# EAGLE design controller (EAGLE 6.3)
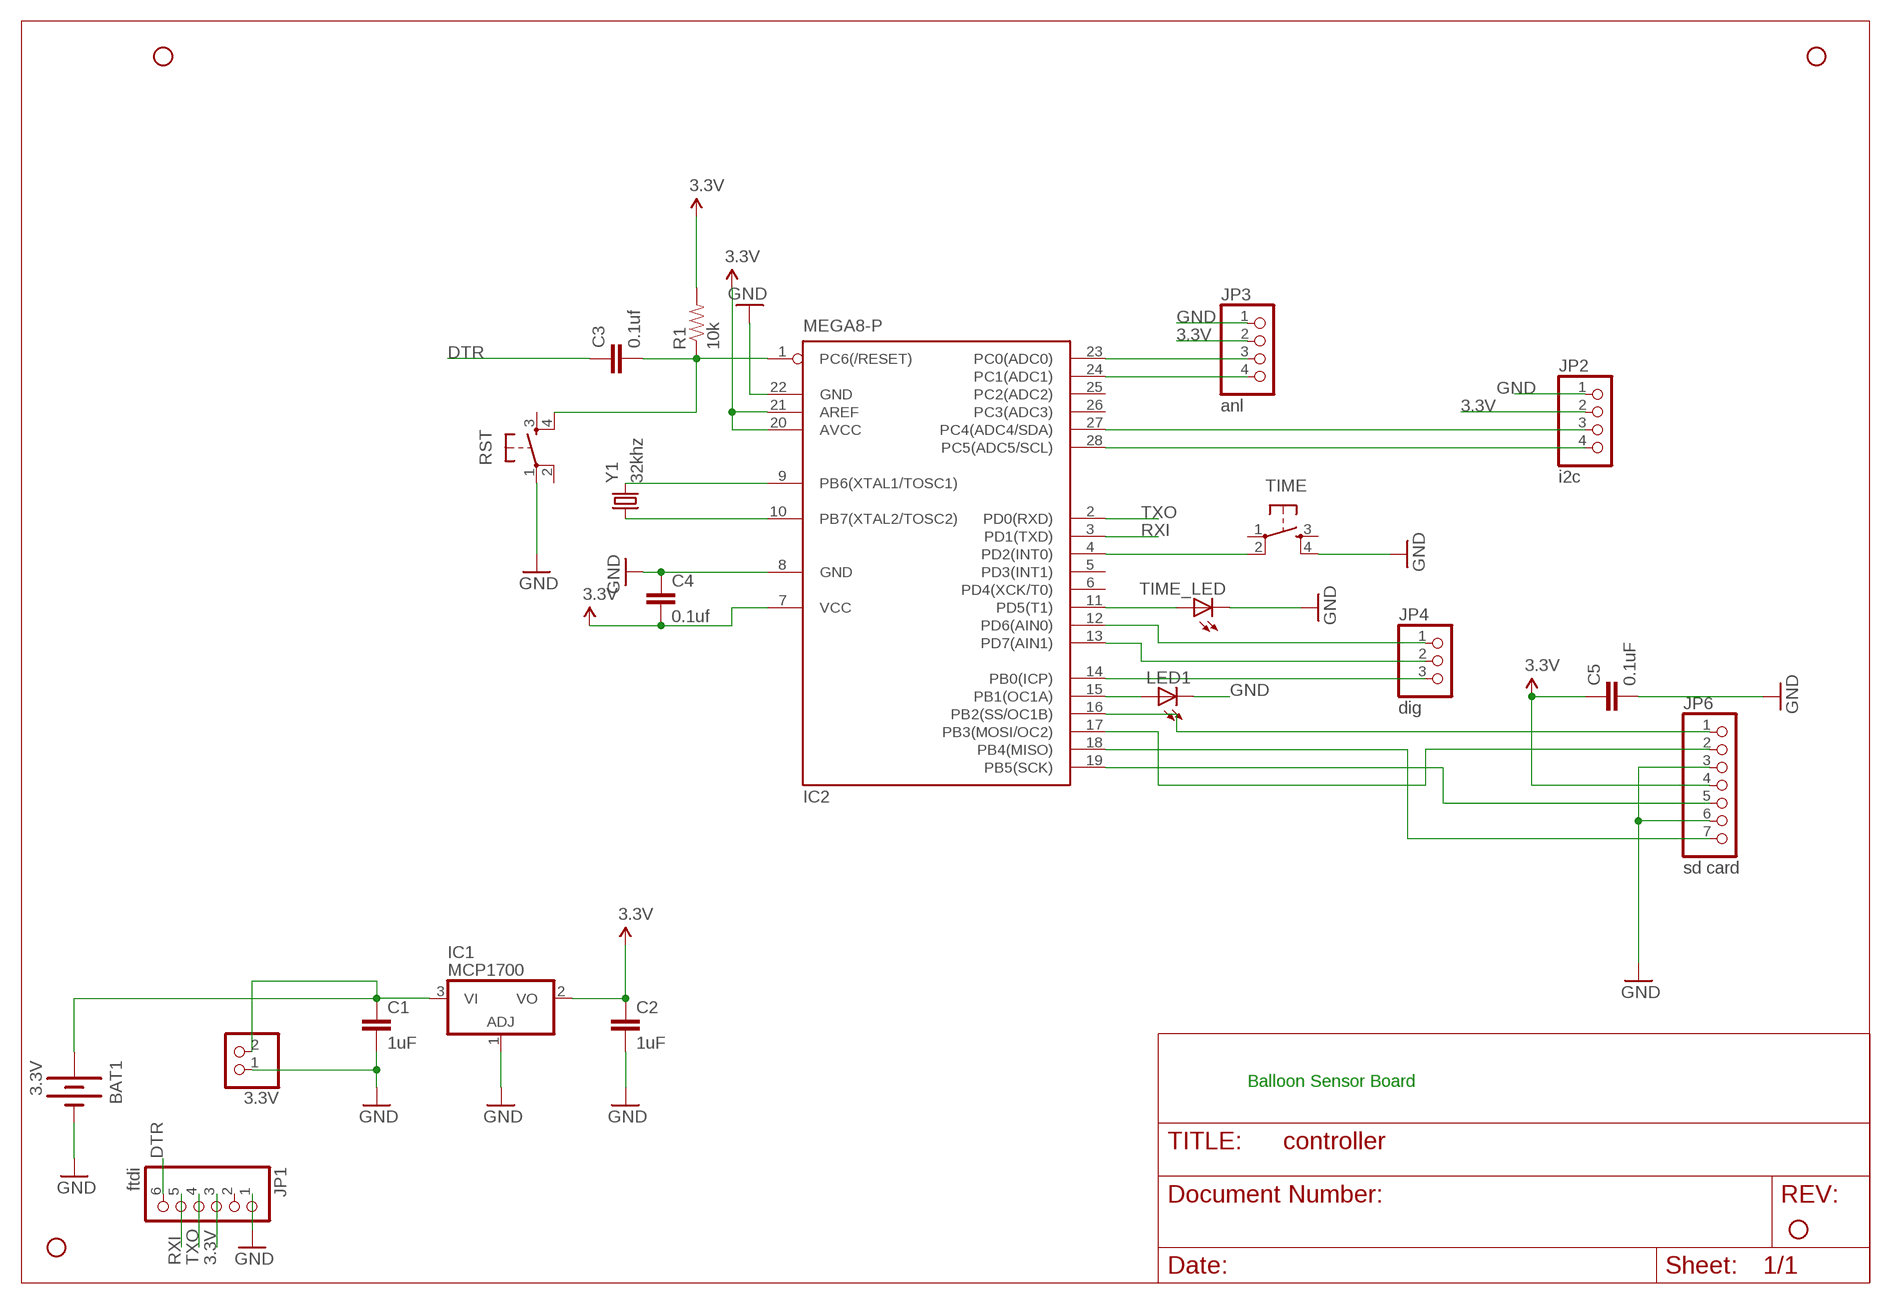
[diagram p0: schematic, sheet 1]

## Parts
3.3V  PINHD-1X2  [1X02]
BAT1  3.3V  BATTERY245MM  [BATTCON_245MM]
C1  1uF  CAPPTH1  [CAP-PTH-5MM]
C2  1uF  CAPPTH1  [CAP-PTH-5MM]
C3  0.1uf  CAPPTH1  [CAP-PTH-5MM]
C4  0.1uf  CAPPTH1  [CAP-PTH-5MM]
C5  0.1uF  CAPPTH1  [CAP-PTH-5MM]
IC1  MCP1700  LM317LZ  [TO92]
IC2  MEGA8-P  [DIL28-3]
JP1  ftdi  PINHD-1X6  [1X06]
JP2  i2c  PINHD-1X4  [1X04]
JP3  anl  PINHD-1X4  [1X04]
JP4  dig  PINHD-1X3  [1X03]
JP6  sd card  PINHD-1X7  [1X07]
LED1  LED5MM  [LED5MM]
R1  10k  RESISTORPTH-1/2W  [AXIAL-0.5]
RST  TAC_SWITCHPTH  [TACTILE-PTH]
STANDOFF1  STAND-OFF  [STAND-OFF]
STANDOFF2  STAND-OFF  [STAND-OFF]
STANDOFF3  STAND-OFF  [STAND-OFF]
STANDOFF4  STAND-OFF  [STAND-OFF]
TIME  TAC_SWITCHPTH  [TACTILE-PTH]
TIME_LED  LED5MM  [LED5MM]
Y1  32khz  CRYSTALTC26H  [TC26H]

## Nets
3.3V: C2.1 C4.2 C5.1 IC1.2(VO) IC2.7(VCC) IC2.20(AVCC) IC2.21(AREF) JP1.3 JP2.2 JP3.2 JP6.4 R1.P$2
+: 3.3V.2 BAT1.1(+) C1.1 IC1.3(VI)
DTR: C3.1 JP1.6
GND: 3.3V.1 BAT1.2(-) C1.2 C2.2 C4.1 C5.2 IC1.1(ADJ) IC2.8(GND) IC2.22(GND) JP1.1 JP2.1 JP3.1 JP6.3 JP6.6 LED1.K(C) RST.1 TIME.4 TIME_LED.K(C)
N$1: C3.2 IC2.1(PC6(/RESET)) R1.P$1 RST.4
N$2: IC2.15(PB1(OC1A)) LED1.A
N$3: IC2.28(PC5(ADC5/SCL)) JP2.4
N$4: IC2.9(PB6(XTAL1/TOSC1)) Y1.2
N$5: IC2.10(PB7(XTAL2/TOSC2)) Y1.1
N$6: IC2.14(PB0(ICP)) JP4.3
N$7: IC2.4(PD2(INT0)) TIME.2
N$8: IC2.13(PD7(AIN1)) JP4.2
N$9: IC2.27(PC4(ADC4/SDA)) JP2.3
N$10: IC2.24(PC1(ADC1)) JP3.4
N$11: IC2.23(PC0(ADC0)) JP3.3
N$12: IC2.12(PD6(AIN0)) JP4.1
N$13: IC2.11(PD5(T1)) TIME_LED.A
N$15: IC2.19(PB5(SCK)) JP6.5
N$16: IC2.18(PB4(MISO)) JP6.7
N$17: IC2.16(PB2(SS/OC1B)) JP6.1
N$18: IC2.17(PB3(MOSI/OC2)) JP6.2
RXI: IC2.3(PD1(TXD)) JP1.5
TXO: IC2.2(PD0(RXD)) JP1.4
Unconnected: IC2.5(PD3(INT1)) IC2.6(PD4(XCK/T0)) IC2.25(PC2(ADC2)) IC2.26(PC3(ADC3)) JP1.2 RST.2 RST.3 TIME.1 TIME.3

## Notes on the sheet
- +
- +
- Balloon Sensor Board

## Library data of the parts
3.3V = pinhead:PINHD-1X2: PIN HEADER
BAT1 = SparkFun:BATTERY: Battery Holders Various common sizes : AA, AAA, 20mm coin cell and 12mm coin cell.
C1-C5 = SparkFun:CAP: Capacitor Standard 0603 ceramic capacitor, and 0.1" leaded capacitor.
IC1 = linear:*317: Positive VOLTAGE REGULATOR
IC2 = atmel:MEGA8-P: MICROCONTROLLER 8 Kbytes FLASH, 1 kbytes SRAM, 512 bytes EEPROM, USART, 4-channel 10 bit ADC, 2-channel 8 bit ADC Pin compatible with Atmega48, ATMega88, ATMega168 Source: avr.lbr
JP1 = pinhead:PINHD-1X6: PIN HEADER
JP2 JP3 = pinhead:PINHD-1X4: PIN HEADER
JP4 = pinhead:PINHD-1X3: PIN HEADER
JP6 = pinhead:PINHD-1X7: PIN HEADER
LED1 TIME_LED = SparkFun:LED: LEDs Standard schematic elements and footprints for 5mm, 3mm, 1206, and 0603 sized LEDs. 5mm - Spark Fun Electronics SKU : COM-00529 (and others)
R1 = SparkFun:RESISTOR: Resistor Basic schematic elements and footprints for 0603, 1206, and PTH resistors.
RST TIME = SparkFun:TAC_SWITCH: Momentary Switch Button commonly used for reset or general input. Spark Fun Electronics SKU : COM-00097
STANDOFF1-STANDOFF4 = SparkFun-Electromechanical:STAND-OFF: #4 Stand Off This is the mechanical footprint for a #4 phillips button head screw. Use the keepout ring to avoid running the screw head into surrounding components. SKU : PRT-00447
Y1 = SparkFun:CRYSTAL: Crystals Various standard crystals. Proven footprints. Spark Fun Electronics SKU : COM-00534

## Board
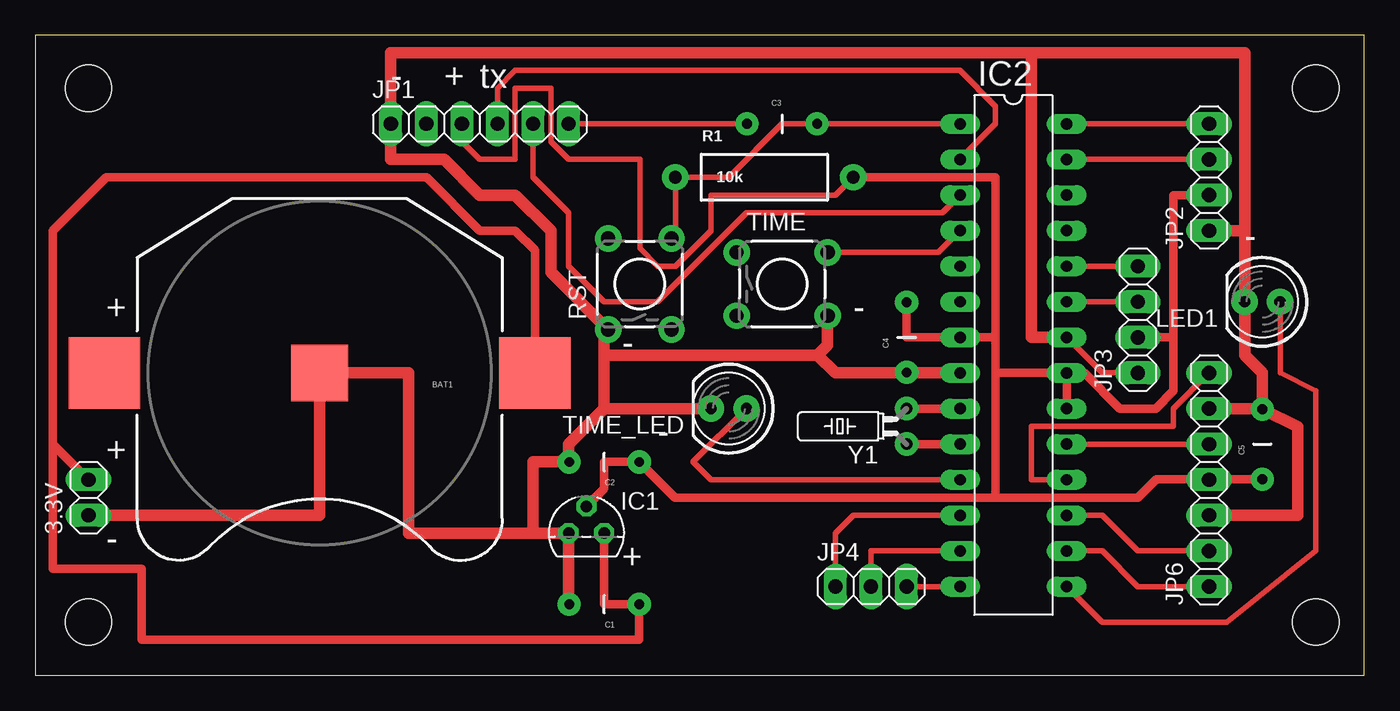
[diagram p1: board, top side]

Size 94.92 x 45.71 mm. Coordinates in mm from the lower left corner, seen from the top.
Outline: 0,0 94.92,0 94.92,45.71 0,45.71 0,0
Copper layers (1*16): Top 0.035mm / dielectric 1.5mm / Bottom 0.035mm
Design rules "SparkFun": minimum track width 8mil, minimum drill 20mil, track to track 8mil, track to pad 8mil, pad to pad 8mil, via to via 8mil, smd to smd 8mil, copper to edge 10mil, drill to drill 8mil, minimum pad ring 12mil, minimum via ring 10mil, stop-mask expansion 4mil, vias tented up to drill 25mil, thermal gap 10mil

### Footprints (pad centres in the part's own frame; a part is rotated, then mirrored left to right if it is on the bottom)
1X02 = drill 1.016 long: 1 -1.27,0; 2 1.27,0
BATTCON_245MM = smd 5.08 x 5.08: 1 -15.367,0; 3 15.367,0 | smd 4.064 x 4.064: 2 0,0
CAP-PTH-5MM = drill 0.7 pad 1.651: 1 -2.5,0; 2 2.5,0
TO92 = drill 0.813 octagon: 1 -1.27,0; 2 0,1.905; 3 1.27,0
DIL28-3 = drill 0.813 long: 1 -16.51,-3.81; 2 -13.97,-3.81; 3 -11.43,-3.81; 4 -8.89,-3.81; 5 -6.35,-3.81; 6 -3.81,-3.81; 7 -1.27,-3.81; 8 1.27,-3.81; 9 3.81,-3.81; 10 6.35,-3.81; 11 8.89,-3.81; 12 11.43,-3.81; 13 13.97,-3.81; 14 16.51,-3.81; 15 16.51,3.81; 16 13.97,3.81; 17 11.43,3.81; 18 8.89,3.81; 19 6.35,3.81; 20 3.81,3.81; 21 1.27,3.81; 22 -1.27,3.81; 23 -3.81,3.81; 24 -6.35,3.81; 25 -8.89,3.81; 26 -11.43,3.81; 27 -13.97,3.81; 28 -16.51,3.81
1X06 = drill 1.016 long: 1 -6.35,0; 2 -3.81,0; 3 -1.27,0; 4 1.27,0; 5 3.81,0; 6 6.35,0
1X04 = drill 1.016 long: 1 -3.81,0; 2 -1.27,0; 3 1.27,0; 4 3.81,0
1X03 = drill 1.016 long: 1 -2.54,0; 2 0,0; 3 2.54,0
1X07 = drill 1.016 long: 1 -7.62,0; 2 -5.08,0; 3 -2.54,0; 4 0,0; 5 2.54,0; 6 5.08,0; 7 7.62,0
LED5MM = drill 0.813 pad 1.88: A -1.27,0; K 1.27,0
AXIAL-0.5 = drill 0.9 pad 1.88: P$1 -6.35,0; P$2 6.35,0
TACTILE-PTH = drill 1.016 pad 1.88: 1 -3.251,2.261; 2 3.251,2.261; 3 -3.251,-2.261; 4 3.251,-2.261
STAND-OFF = hole 3.302: 0,0
TC26H = drill 0.813 pad 1.676: 1 -1.27,0; 2 1.27,0

### Placement (x,y rotation side)
3.3V  3.81,12.7 90 top
BAT1  20.32,21.59 180 top
C1  40.64,5.08 180 top
C2  40.64,15.24 180 top
C3  53.34,39.37 0 top
C4  62.23,24.13 90 top
C5  87.63,16.51 90 top
IC1  39.37,10.16 0 top
IC2  69.85,22.86 270 top
JP1  31.75,39.37 0 top
JP2  83.82,35.56 90 top
JP3  78.74,25.4 90 top
JP4  59.69,6.35 0 top
JP6  83.82,13.97 90 top
LED1  87.63,26.67 180 top
R1  52.07,35.56 0 top
RST  43.18,27.94 90 top
STANDOFF1  3.81,3.81 0 top
STANDOFF2  91.44,3.81 0 top
STANDOFF3  91.44,41.91 0 top
STANDOFF4  3.81,41.91 0 top
TIME  53.34,27.94 0 top
TIME_LED  49.53,19.05 180 top
Y1  62.23,17.78 90 top

### Tracks (layer width: path | path; a pad name or v marks a point on that pad's centre or on a via)
3.3V
  Top 0.406: JP1.3 30.48,38.1 31.75,36.83 34.29,36.83 34.29,41.91 36.83,41.91 36.83,38.1 38.1,36.83 43.18,36.83 43.18,30.48 44.45,29.21 45.72,29.21 48.26,31.75 48.26,34.29 57.15,34.29 R1.P$2
  Top 0.61: C5.1 83.86,14.01 | 83.86,14.01 JP6.4 | C4.2 62.23,24.13 IC2.7 68.58,24.13 | IC2.21 IC2.20 | IC1.2 40.64,13.34 40.64,15.24 C2.1 45.68,12.7 68.58,12.7 | 68.58,12.7 68.58,21.59 | 68.58,21.59 68.58,24.13 | IC2.21 68.58,21.59 | R1.P$2 68.58,35.56 68.58,24.13 | 83.86,14.01 80.05,14.01 78.74,12.7 68.58,12.7 | IC2.21 74.93,21.59 77.47,19.05 80.01,19.05 81.28,20.32 81.28,24.13 | JP3.2 81.28,24.13 | 81.28,24.13 81.28,34.29 JP2.2
+
  Top 0.61: BAT1.1 35.69,30.35 34.29,31.75 31.75,31.75 27.94,35.56 5.08,35.56 1.27,31.75 1.27,16.51 | 1.27,16.51 3.3V.2 | 1.27,16.51 1.27,7.62 7.62,7.62 7.62,2.54 43.14,2.54 C1.1 40.64,5.08 IC1.3
DTR
  Top 0.406: C3.1 JP1.6
GND
  Top 0.406: JP3.1 76.2,21.59 IC2.22
  Top 0.813: 3.3V.1 20.32,11.43 BAT1.2 26.67,21.59 26.67,10.16 35.56,10.16 | 35.56,10.16 IC1.1 | C1.2 38.1,5.08 IC1.1 | IC1.1 38.14,10.16 | 35.56,10.16 35.56,15.24 C2.2 38.1,15.24 38.1,16.51 40.64,19.05 | 40.64,19.05 TIME_LED.K | 40.64,19.05 40.64,22.86 | 40.64,22.86 40.64,24.41 RST.1 36.83,28.78 36.83,31.75 34.29,34.29 31.75,34.29 29.21,36.83 25.4,36.83 JP1.1 25.4,44.45 71.12,44.45 | TIME.4 56.59,23.57 55.88,22.86 | 55.88,22.86 40.64,22.86 | IC2.8 62.27,21.59 C4.1 62.23,21.59 57.15,21.59 55.88,22.86 | IC2.22 71.12,24.13 71.12,44.45 | JP2.1 86.36,31.75 | 86.36,31.75 86.36,44.45 71.12,44.45 | C5.2 87.63,21.59 86.36,22.86 LED1.K 86.36,31.75 | JP6.6 87.59,19.05 C5.2 | JP6.3 90.17,11.43 90.17,17.74 C5.2
N$1
  Top 0.406: IC2.1 C3.2 53.34,39.37 49.53,35.56 R1.P$1 45.72,31.47 RST.4
N$2
  Top 0.406: LED1.A 88.9,21.59 91.44,20.32 91.44,8.89 85.09,3.81 76.2,3.81 IC2.15
N$3
  Top 0.406: IC2.28 JP2.4
N$4
  Top 0.61: IC2.9 Y1.2
N$5
  Top 0.61: IC2.10 Y1.1
N$6
  Top 0.406: IC2.14 JP4.3
N$7
  Top 0.406: TIME.2 64.49,30.2 IC2.4
N$8
  Top 0.406: IC2.13 59.69,8.89 JP4.2
N$9
  Top 0.406: IC2.27 JP2.3
N$10
  Top 0.406: IC2.24 JP3.4
N$11
  Top 0.406: IC2.23 JP3.3
N$12
  Top 0.406: IC2.12 58.42,11.43 57.15,10.16 JP4.1
N$13
  Top 0.406: TIME_LED.A 46.99,15.24 48.26,13.97 IC2.11
N$15
  Top 0.406: IC2.19 JP6.5
N$16
  Top 0.406: IC2.18 71.12,13.97 71.12,17.78 81.28,17.78 81.28,19.05 JP6.7
N$17
  Top 0.406: IC2.16 76.2,8.89 78.74,6.35 JP6.1
N$18
  Top 0.406: IC2.17 76.2,11.43 78.74,8.89 JP6.2
RXI
  Top 0.406: JP1.5 35.56,35.56 38.1,33.02 38.1,29.21 40.64,26.67 44.45,26.67 50.8,33.02 64.77,33.02 IC2.3
TXO
  Top 0.406: JP1.4 33.02,41.91 34.29,43.18 66.04,43.18 68.58,40.64 68.58,39.37 IC2.2

### Text on the board
tPlace: - | + | tx | - | + | - | - | - | + | - | +